# Altium schematic sheet design_12.SchDoc
size 414 x 279 mm; Origin: Eagle
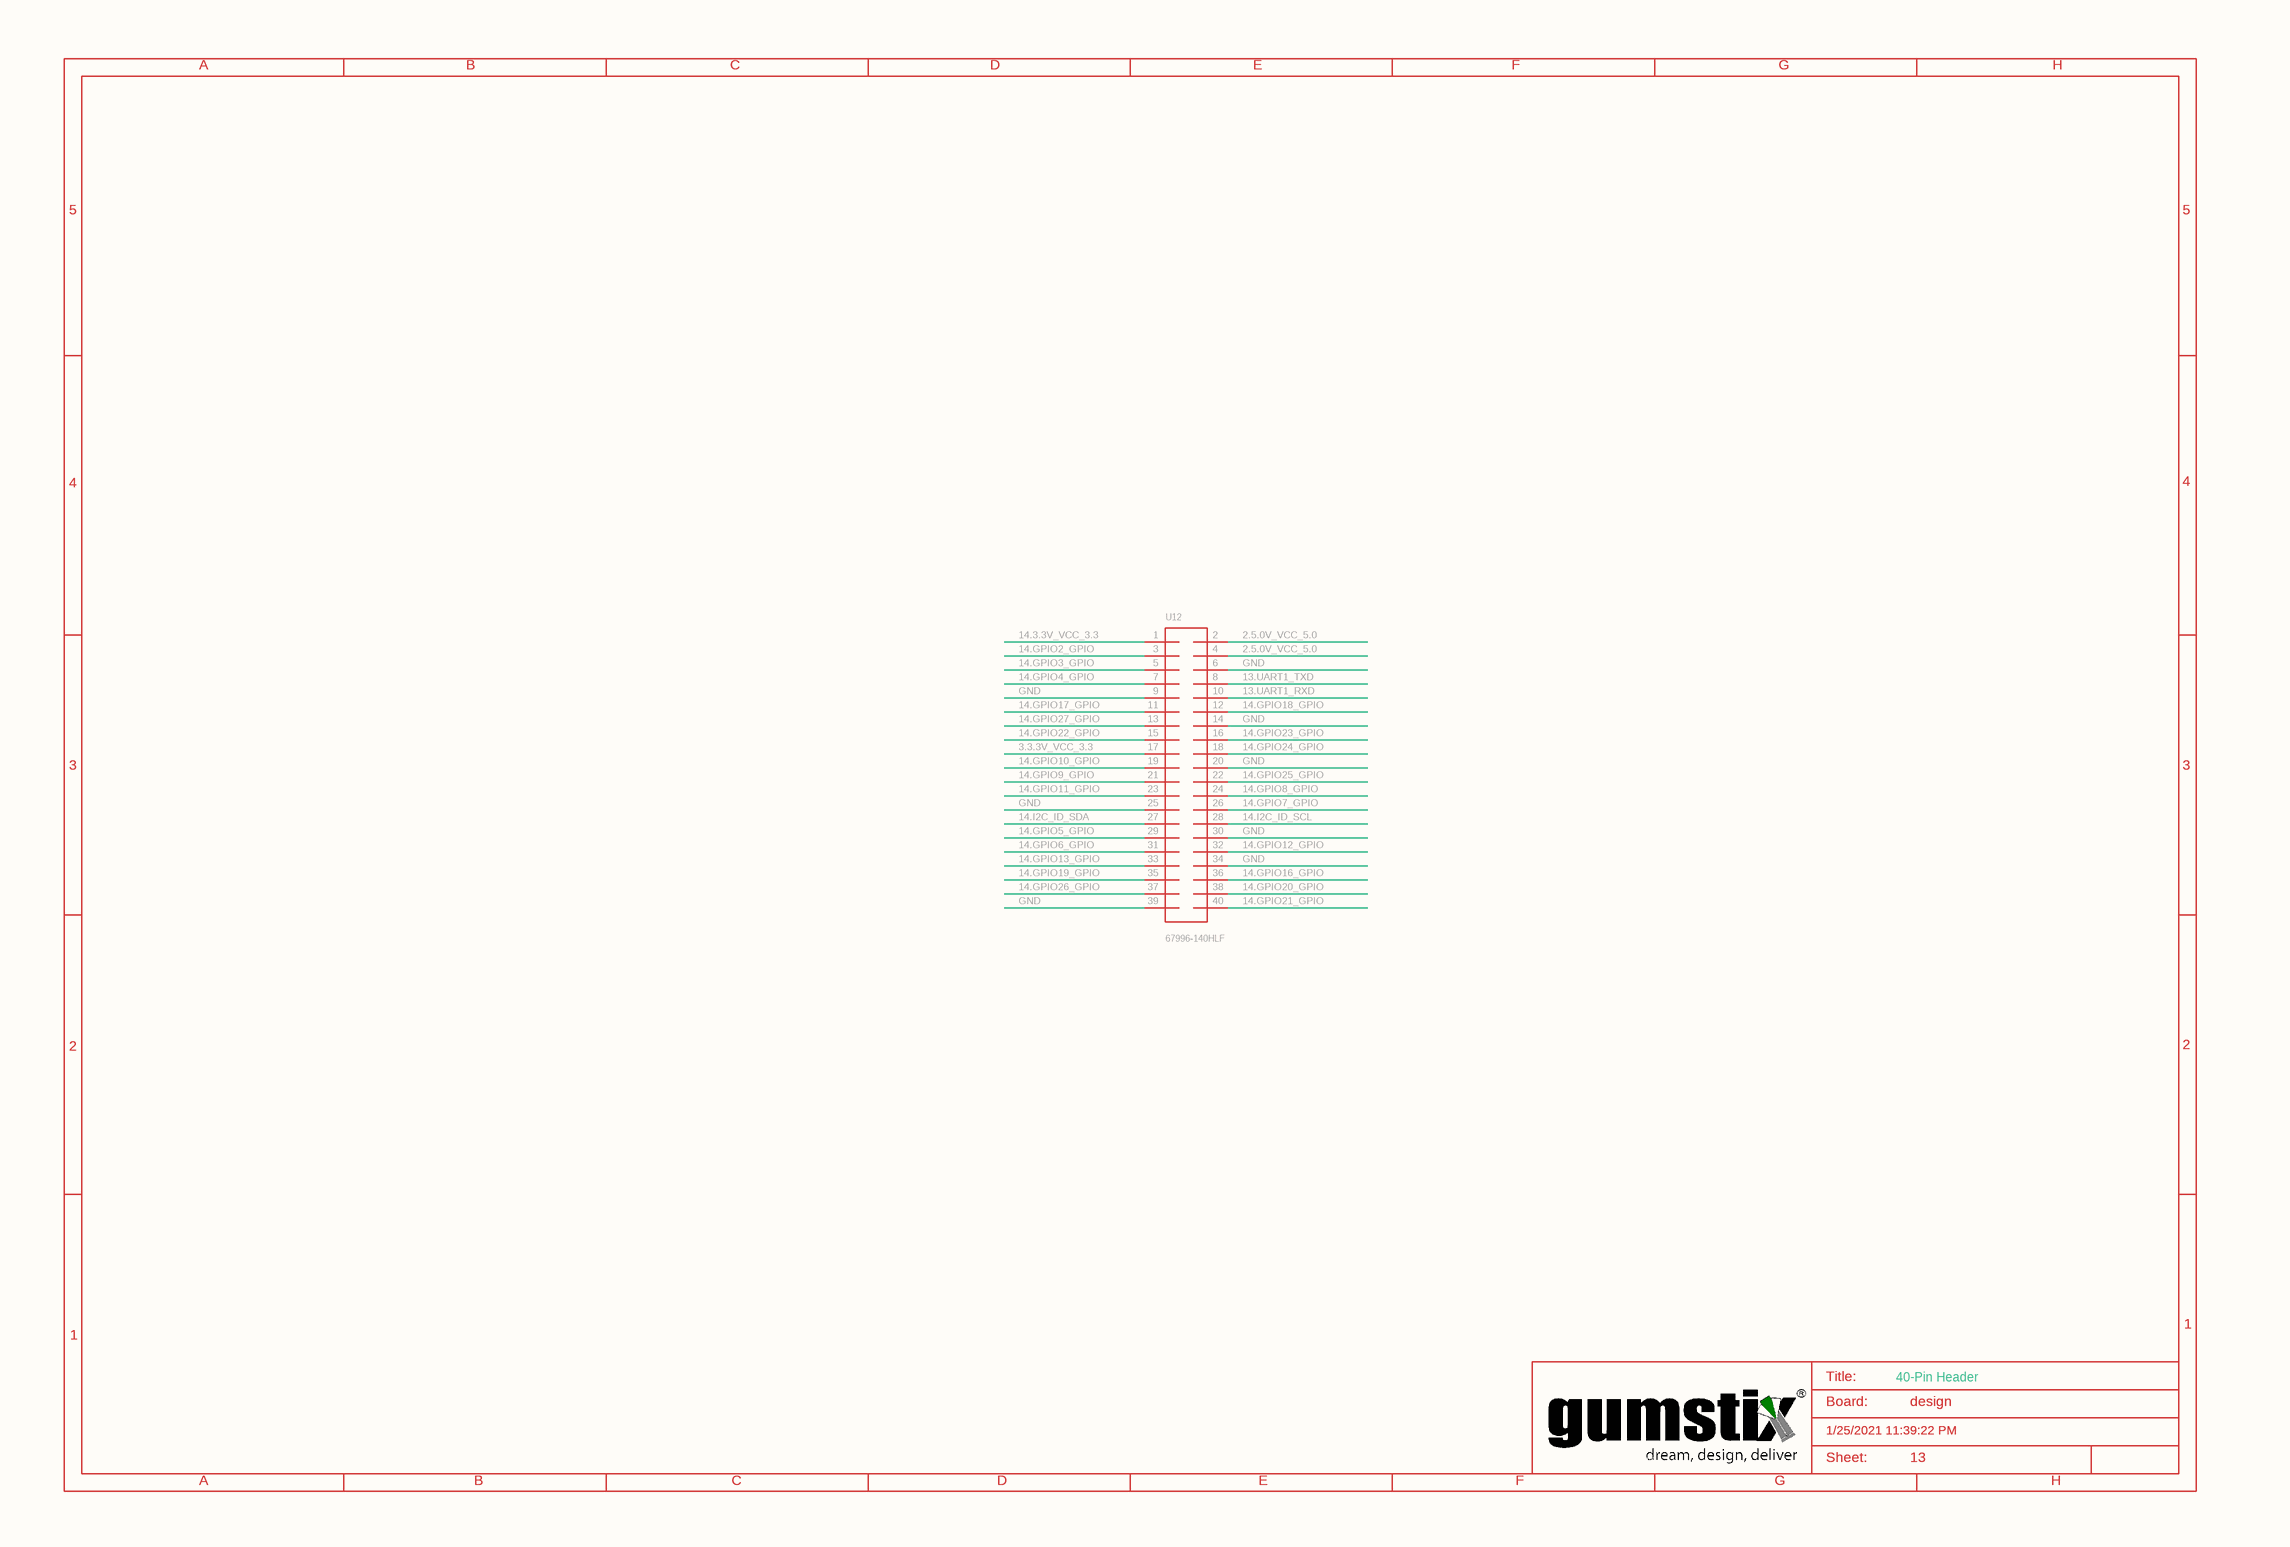
[diagram p0: design_12.SchDoc]

## Parts
U12  67996-140HLF  [2X20]
U$5  DRAWING_NAME: design  LAST_DATE_TIME: 1/25/2021 11:39:22 PM  SHEET: 13  Sheet: Sheet:  Title: Title:  Board: Board:  (hidden comment: A3-L-GUMSTIX)
U$27  DRAWING_NAME: design  LAST_DATE_TIME: 1/25/2021 11:39:22 PM  SHEET: 13  Sheet: Sheet:  Title: Title:  Board: Board:  (hidden comment: A3-L-GUMSTIX)

## Nets
2.5.0V_VCC_5.0: U12.2 U12.4
3.3.3V_VCC_3.3: U12.17
13.UART1_RXD: U12.10
13.UART1_TXD: U12.8
14.3.3V_VCC_3.3: U12.1
14.GPIO2_GPIO: U12.3
14.GPIO3_GPIO: U12.5
14.GPIO4_GPIO: U12.7
14.GPIO5_GPIO: U12.29
14.GPIO6_GPIO: U12.31
14.GPIO7_GPIO: U12.26
14.GPIO8_GPIO: U12.24
14.GPIO9_GPIO: U12.21
14.GPIO10_GPIO: U12.19
14.GPIO11_GPIO: U12.23
14.GPIO12_GPIO: U12.32
14.GPIO13_GPIO: U12.33
14.GPIO16_GPIO: U12.36
14.GPIO17_GPIO: U12.11
14.GPIO18_GPIO: U12.12
14.GPIO19_GPIO: U12.35
14.GPIO20_GPIO: U12.38
14.GPIO21_GPIO: U12.40
14.GPIO22_GPIO: U12.15
14.GPIO23_GPIO: U12.16
14.GPIO24_GPIO: U12.18
14.GPIO25_GPIO: U12.22
14.GPIO26_GPIO: U12.37
14.GPIO27_GPIO: U12.13
14.I2C_ID_SCL: U12.28
14.I2C_ID_SDA: U12.27
GND: U12.6 U12.9 U12.14 U12.20 U12.25 U12.30 U12.34 U12.39

## Notes on the sheet
- 40-Pin Header

## Library data of the parts
U12 = 67996-140HLF: GateName_1: G$1; SymbolName_1: 2X20_2.54X2.54MM_PITCH; LibraryName: qualified_1; DeviceSetName: 67996-140HLF
U$5 U$27 = A3-L-GUMSTIX: GateName_1: G$1; SymbolName_1: A3-L-GUMSTIX; LibraryName: qualified_1; DeviceSetName: A3-L-GUMSTIX; A: A; B: B; C: C; D: D; E: E; F: F; G: G; H: H; 1: 1; 2: 2; 3: 3; 4: 4; 5: 5; C:/Gumstix/gumstix-logo-16.bmp: C:/Gumstix/gumstix-logo-16.bmp